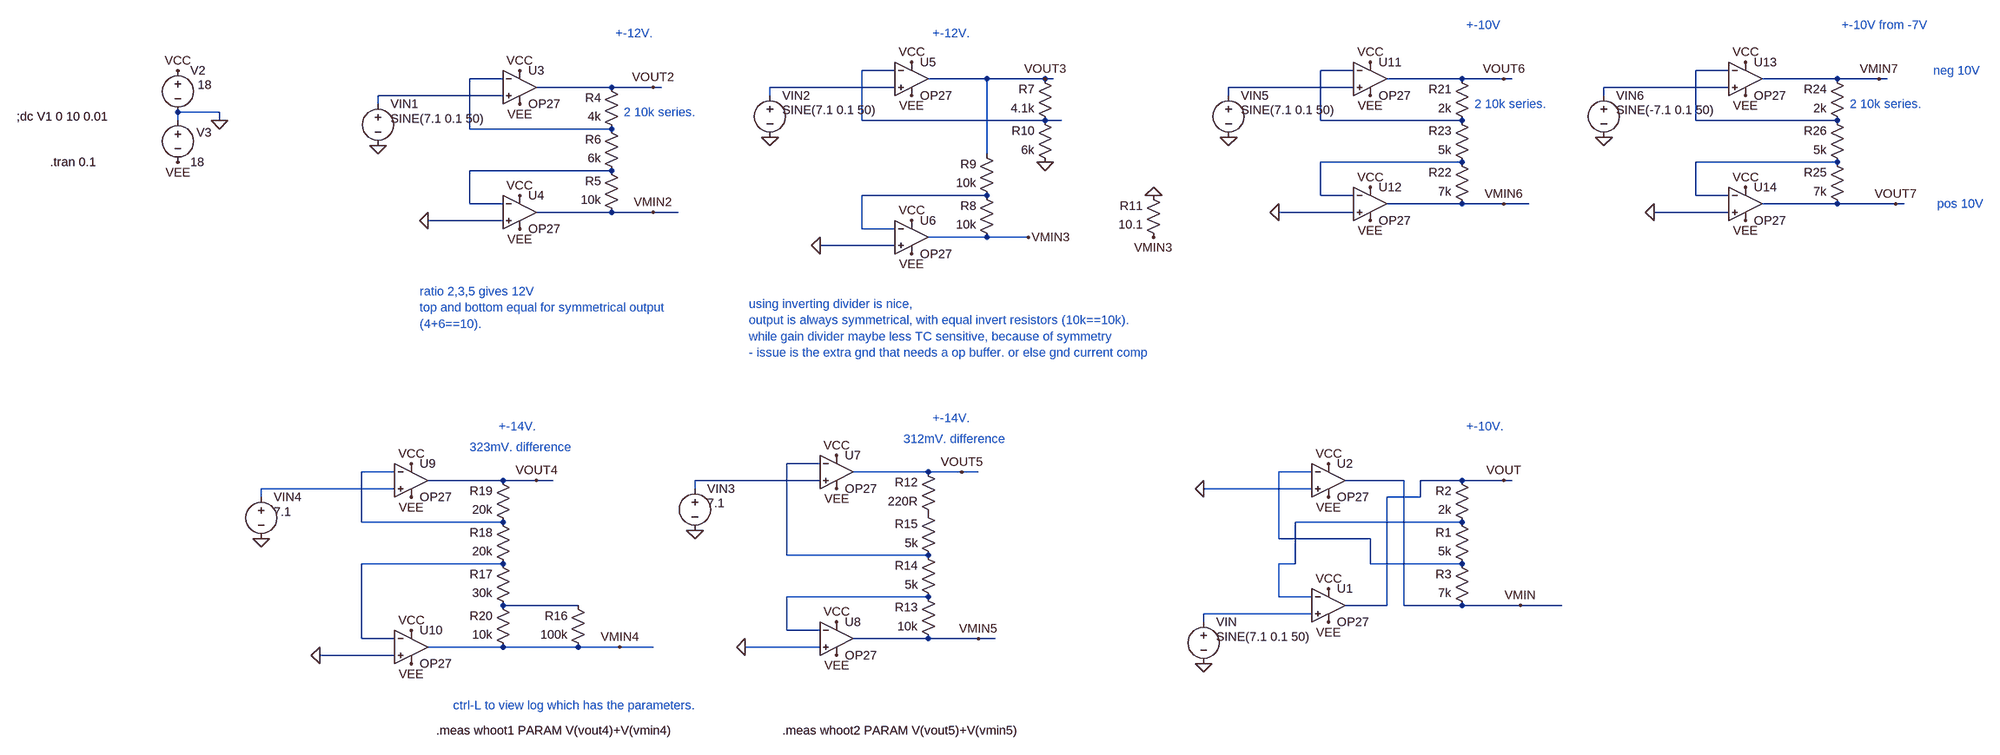
[diagram p0: schematic Draft23.asc]
Draft23.asc, the LTspice schematic file:
Version 4
SHEET 1 3336 1280
WIRE 1232 -48 1168 -48
WIRE 2112 -48 2048 -48
WIRE 2832 -48 2768 -48
WIRE 480 -32 416 -32
WIRE 1408 -32 1296 -32
WIRE 1520 -32 1408 -32
WIRE 1536 -32 1520 -32
WIRE 2320 -32 2176 -32
WIRE 2400 -32 2320 -32
WIRE 2416 -32 2400 -32
WIRE 3040 -32 2896 -32
WIRE 3120 -32 3040 -32
WIRE 3136 -32 3120 -32
WIRE 688 -16 544 -16
WIRE 768 -16 688 -16
WIRE 784 -16 768 -16
WIRE 1232 -16 992 -16
WIRE 2112 -16 1872 -16
WIRE 2832 -16 2592 -16
WIRE 480 0 240 0
WIRE 992 0 992 -16
WIRE 1872 0 1872 -16
WIRE 2592 0 2592 -16
WIRE 240 16 240 0
WIRE -64 32 -144 32
WIRE -144 48 -144 32
WIRE -64 48 -64 32
WIRE 1168 48 1168 -48
WIRE 1520 48 1168 48
WIRE 1552 48 1520 48
WIRE 2048 48 2048 -48
WIRE 2320 48 2048 48
WIRE 2768 48 2768 -48
WIRE 3040 48 2768 48
WIRE 416 64 416 -32
WIRE 688 64 416 64
WIRE 1408 112 1408 -32
WIRE 2320 128 2048 128
WIRE 3040 128 2768 128
WIRE 688 144 416 144
WIRE 1408 192 1168 192
WIRE 2048 192 2048 128
WIRE 2112 192 2048 192
WIRE 2768 192 2768 128
WIRE 2832 192 2768 192
WIRE 416 208 416 144
WIRE 480 208 416 208
WIRE 2320 208 2176 208
WIRE 2400 208 2320 208
WIRE 2448 208 2400 208
WIRE 3040 208 2896 208
WIRE 3152 208 3040 208
WIRE 3168 208 3152 208
WIRE 688 224 544 224
WIRE 768 224 688 224
WIRE 816 224 768 224
WIRE 2112 224 1968 224
WIRE 2832 224 2688 224
WIRE 480 240 336 240
WIRE 1168 256 1168 192
WIRE 1232 256 1168 256
WIRE 1408 272 1296 272
WIRE 1488 272 1408 272
WIRE 1232 288 1088 288
WIRE 1088 752 1024 752
WIRE 272 768 208 768
WIRE 1296 768 1152 768
WIRE 1360 768 1296 768
WIRE 1392 768 1360 768
WIRE 2032 768 1968 768
WIRE 480 784 336 784
WIRE 544 784 480 784
WIRE 576 784 544 784
WIRE 1088 784 848 784
WIRE 2208 784 2096 784
WIRE 2320 784 2240 784
WIRE 2400 784 2320 784
WIRE 2416 784 2400 784
WIRE 272 800 16 800
WIRE 848 800 848 784
WIRE 2032 800 1824 800
WIRE 16 816 16 800
WIRE 2240 816 2240 784
WIRE 2240 816 2176 816
WIRE 208 864 208 768
WIRE 480 864 208 864
WIRE 2320 864 2000 864
WIRE 1968 896 1968 768
WIRE 2144 896 1968 896
WIRE 1024 928 1024 752
WIRE 1296 928 1024 928
WIRE 480 944 208 944
WIRE 2000 944 2000 864
WIRE 2000 944 1968 944
WIRE 2144 944 2144 896
WIRE 2320 944 2144 944
WIRE 1296 1008 1024 1008
WIRE 1968 1008 1968 944
WIRE 2032 1008 1968 1008
WIRE 624 1024 480 1024
WIRE 2176 1024 2176 816
WIRE 2176 1024 2096 1024
WIRE 2208 1024 2208 784
WIRE 2320 1024 2208 1024
WIRE 2432 1024 2320 1024
WIRE 2512 1024 2432 1024
WIRE 2032 1040 1824 1040
WIRE 1824 1056 1824 1040
WIRE 1024 1072 1024 1008
WIRE 1088 1072 1024 1072
WIRE 208 1088 208 944
WIRE 272 1088 208 1088
WIRE 1296 1088 1152 1088
WIRE 1392 1088 1296 1088
WIRE 1424 1088 1392 1088
WIRE 480 1104 336 1104
WIRE 624 1104 480 1104
WIRE 704 1104 624 1104
WIRE 768 1104 704 1104
WIRE 1088 1104 944 1104
WIRE 272 1120 128 1120
FLAG 1824 1136 0
FLAG -64 48 0
FLAG 2400 784 VOUT
FLAG -144 -48 VCC
FLAG 2064 752 VCC
FLAG -144 128 VEE
FLAG 2064 816 VEE
FLAG 2064 992 VCC
FLAG 2064 1056 VEE
FLAG 2432 1024 VMIN
FLAG 1824 800 0
FLAG 240 96 0
FLAG 768 -16 VOUT2
FLAG 512 -48 VCC
FLAG 512 16 VEE
FLAG 512 192 VCC
FLAG 512 256 VEE
FLAG 768 224 VMIN2
FLAG 336 240 0
FLAG 992 80 0
FLAG 1520 -32 VOUT3
FLAG 1264 -64 VCC
FLAG 1264 0 VEE
FLAG 1264 240 VCC
FLAG 1264 304 VEE
FLAG 1488 272 VMIN3
FLAG 1088 288 0
FLAG 1520 128 0
FLAG 1728 192 0
FLAG 1728 272 VMIN3
FLAG 848 880 0
FLAG 544 784 VOUT4
FLAG 1120 736 VCC
FLAG 1120 800 VEE
FLAG 1120 1056 VCC
FLAG 1120 1120 VEE
FLAG 704 1104 VMIN4
FLAG 944 1104 0
FLAG 16 896 0
FLAG 1360 768 VOUT5
FLAG 304 752 VCC
FLAG 304 816 VEE
FLAG 304 1072 VCC
FLAG 304 1136 VEE
FLAG 1392 1088 VMIN5
FLAG 128 1120 0
FLAG 1872 80 0
FLAG 2400 -32 VOUT6
FLAG 2144 -64 VCC
FLAG 2144 0 VEE
FLAG 2144 176 VCC
FLAG 2144 240 VEE
FLAG 2400 208 VMIN6
FLAG 1968 224 0
FLAG 2592 80 0
FLAG 3152 208 VOUT7
FLAG 2864 -64 VCC
FLAG 2864 0 VEE
FLAG 2864 176 VCC
FLAG 2864 240 VEE
FLAG 3120 -32 VMIN7
FLAG 2688 224 0
SYMBOL voltage 1824 1040 R0
WINDOW 123 0 0 Left 0
WINDOW 39 0 0 Left 0
WINDOW 3 24 44 Left 2
SYMATTR Value SINE(7.1 0.1 50)
SYMATTR InstName VIN
SYMBOL voltage -144 -64 R0
WINDOW 123 0 0 Left 0
WINDOW 39 0 0 Left 0
WINDOW 3 38 43 Left 2
SYMATTR Value 18
SYMATTR InstName V2
SYMBOL voltage -144 32 R0
WINDOW 123 0 0 Left 0
WINDOW 39 0 0 Left 0
WINDOW 0 36 39 Left 2
SYMATTR InstName V3
SYMATTR Value 18
SYMBOL res 2336 880 R180
WINDOW 0 36 76 Left 2
WINDOW 3 36 40 Left 2
SYMATTR InstName R2
SYMATTR Value 2k
SYMBOL res 2336 1040 R180
WINDOW 0 36 76 Left 2
WINDOW 3 36 40 Left 2
SYMATTR InstName R3
SYMATTR Value 7k
SYMBOL OpAmps\\OP27 2064 720 R0
SYMATTR InstName U2
SYMBOL OpAmps\\OP27 2064 960 R0
SYMATTR InstName U1
SYMBOL res 2336 960 R180
WINDOW 0 36 76 Left 2
WINDOW 3 36 40 Left 2
SYMATTR InstName R1
SYMATTR Value 5k
SYMBOL voltage 240 0 R0
WINDOW 123 0 0 Left 0
WINDOW 39 0 0 Left 0
WINDOW 3 24 44 Left 2
SYMATTR Value SINE(7.1 0.1 50)
SYMATTR InstName VIN1
SYMBOL res 704 80 R180
WINDOW 0 36 76 Left 2
WINDOW 3 36 40 Left 2
SYMATTR InstName R4
SYMATTR Value 4k
SYMBOL res 704 240 R180
WINDOW 0 36 76 Left 2
WINDOW 3 36 40 Left 2
SYMATTR InstName R5
SYMATTR Value 10k
SYMBOL OpAmps\\OP27 512 -80 R0
SYMATTR InstName U3
SYMBOL OpAmps\\OP27 512 160 R0
SYMATTR InstName U4
SYMBOL res 704 160 R180
WINDOW 0 36 76 Left 2
WINDOW 3 36 40 Left 2
SYMATTR InstName R6
SYMATTR Value 6k
SYMBOL voltage 992 -16 R0
WINDOW 123 0 0 Left 0
WINDOW 39 0 0 Left 0
WINDOW 3 24 44 Left 2
SYMATTR Value SINE(7.1 0.1 50)
SYMATTR InstName VIN2
SYMBOL res 1536 64 R180
WINDOW 0 36 76 Left 2
WINDOW 3 36 40 Left 2
SYMATTR InstName R7
SYMATTR Value 4.1k
SYMBOL res 1424 288 R180
WINDOW 0 36 76 Left 2
WINDOW 3 36 40 Left 2
SYMATTR InstName R8
SYMATTR Value 10k
SYMBOL OpAmps\\OP27 1264 -96 R0
SYMATTR InstName U5
SYMBOL OpAmps\\OP27 1264 208 R0
SYMATTR InstName U6
SYMBOL res 1424 208 R180
WINDOW 0 36 76 Left 2
WINDOW 3 36 40 Left 2
SYMATTR InstName R9
SYMATTR Value 10k
SYMBOL res 1536 144 R180
WINDOW 0 36 76 Left 2
WINDOW 3 36 40 Left 2
SYMATTR InstName R10
SYMATTR Value 6k
SYMBOL res 1744 288 R180
WINDOW 0 36 76 Left 2
WINDOW 3 36 40 Left 2
SYMATTR InstName R11
SYMATTR Value 10.1
SYMBOL voltage 848 784 R0
WINDOW 123 0 0 Left 0
WINDOW 39 0 0 Left 0
WINDOW 3 24 44 Left 2
SYMATTR Value 7.1
SYMATTR InstName VIN3
SYMBOL res 1312 864 R180
WINDOW 0 36 76 Left 2
WINDOW 3 36 40 Left 2
SYMATTR InstName R12
SYMATTR Value 220R
SYMBOL res 1312 1104 R180
WINDOW 0 36 76 Left 2
WINDOW 3 36 40 Left 2
SYMATTR InstName R13
SYMATTR Value 10k
SYMBOL OpAmps\\OP27 1120 704 R0
SYMATTR InstName U7
SYMBOL OpAmps\\OP27 1120 1024 R0
SYMATTR InstName U8
SYMBOL res 1312 1024 R180
WINDOW 0 36 76 Left 2
WINDOW 3 36 40 Left 2
SYMATTR InstName R14
SYMATTR Value 5k
SYMBOL res 1312 944 R180
WINDOW 0 36 76 Left 2
WINDOW 3 36 40 Left 2
SYMATTR InstName R15
SYMATTR Value 5k
SYMBOL voltage 16 800 R0
WINDOW 123 0 0 Left 0
WINDOW 39 0 0 Left 0
WINDOW 3 24 44 Left 2
SYMATTR Value 7.1
SYMATTR InstName VIN4
SYMBOL res 496 1040 R180
WINDOW 0 36 76 Left 2
WINDOW 3 36 40 Left 2
SYMATTR InstName R17
SYMATTR Value 30k
SYMBOL OpAmps\\OP27 304 720 R0
SYMATTR InstName U9
SYMBOL OpAmps\\OP27 304 1040 R0
SYMATTR InstName U10
SYMBOL res 496 960 R180
WINDOW 0 36 76 Left 2
WINDOW 3 36 40 Left 2
SYMATTR InstName R18
SYMATTR Value 20k
SYMBOL res 496 880 R180
WINDOW 0 36 76 Left 2
WINDOW 3 36 40 Left 2
SYMATTR InstName R19
SYMATTR Value 20k
SYMBOL res 496 1120 R180
WINDOW 0 36 76 Left 2
WINDOW 3 36 40 Left 2
SYMATTR InstName R20
SYMATTR Value 10k
SYMBOL res 640 1120 R180
WINDOW 0 36 76 Left 2
WINDOW 3 36 40 Left 2
SYMATTR InstName R16
SYMATTR Value 100k
SYMBOL voltage 1872 -16 R0
WINDOW 123 0 0 Left 0
WINDOW 39 0 0 Left 0
WINDOW 3 24 44 Left 2
SYMATTR Value SINE(7.1 0.1 50)
SYMATTR InstName VIN5
SYMBOL res 2336 64 R180
WINDOW 0 36 76 Left 2
WINDOW 3 36 40 Left 2
SYMATTR InstName R21
SYMATTR Value 2k
SYMBOL res 2336 224 R180
WINDOW 0 36 76 Left 2
WINDOW 3 36 40 Left 2
SYMATTR InstName R22
SYMATTR Value 7k
SYMBOL OpAmps\\OP27 2144 -96 R0
SYMATTR InstName U11
SYMBOL OpAmps\\OP27 2144 144 R0
SYMATTR InstName U12
SYMBOL res 2336 144 R180
WINDOW 0 36 76 Left 2
WINDOW 3 36 40 Left 2
SYMATTR InstName R23
SYMATTR Value 5k
SYMBOL voltage 2592 -16 R0
WINDOW 123 0 0 Left 0
WINDOW 39 0 0 Left 0
WINDOW 3 24 44 Left 2
SYMATTR Value SINE(-7.1 0.1 50)
SYMATTR InstName VIN6
SYMBOL res 3056 64 R180
WINDOW 0 36 76 Left 2
WINDOW 3 36 40 Left 2
SYMATTR InstName R24
SYMATTR Value 2k
SYMBOL res 3056 224 R180
WINDOW 0 36 76 Left 2
WINDOW 3 36 40 Left 2
SYMATTR InstName R25
SYMATTR Value 7k
SYMBOL OpAmps\\OP27 2864 -96 R0
SYMATTR InstName U13
SYMBOL OpAmps\\OP27 2864 144 R0
SYMATTR InstName U14
SYMBOL res 3056 144 R180
WINDOW 0 36 76 Left 2
WINDOW 3 36 40 Left 2
SYMATTR InstName R26
SYMATTR Value 5k
TEXT -480 40 Left 2 !;dc V1 0 10 0.01
TEXT -416 128 Left 2 !.tran 0.1
TEXT 2328 680 Left 2 ;+-10V.
TEXT 696 -120 Left 2 ;+-12V.
TEXT 712 32 Left 2 ;2 10k series.
TEXT 320 376 Left 2 ;ratio 2,3,5 gives 12V\ntop and bottom equal for symmetrical output \n(4+6==10).
TEXT 952 400 Left 2 ;using inverting divider is nice,\noutput is always symmetrical, with equal invert resistors (10k==10k).\nwhile gain divider maybe less TC sensitive, because of symmetry\n- issue is the extra gnd that needs a op buffer. or else gnd current comp
TEXT 1304 -120 Left 2 ;+-12V.
TEXT 1304 664 Left 2 ;+-14V.
TEXT 1248 704 Left 2 ;312mV. difference
TEXT 472 680 Left 2 ;+-14V.
TEXT 416 720 Left 2 ;323mV. difference
TEXT 352 1264 Left 2 !.meas whoot1 PARAM V(vout4)+V(vmin4)
TEXT 1016 1264 Left 2 !.meas whoot2 PARAM V(vout5)+V(vmin5)
TEXT 384 1216 Left 2 ;ctrl-L to view log which has the parameters.
TEXT 2328 -136 Left 2 ;+-10V
TEXT 2344 16 Left 2 ;2 10k series.
TEXT 3048 -136 Left 2 ;+-10V from -7V
TEXT 3064 16 Left 2 ;2 10k series.
TEXT 3232 208 Left 2 ;pos 10V
TEXT 3224 -48 Left 2 ;neg 10V

The netlist it stands for:
* Draft23.asc
VIN N022 0 SINE(7.1 0.1 50)
V2 VCC 0 18
V3 0 VEE 18
R2 N018 VOUT 2k
R3 VMIN N015 7k
XU2 0 N015 VCC VEE VMIN OP27  ; pins In+ In- V+ V- OUT
XU1 N022 N018 VCC VEE VOUT OP27  ; pins In+ In- V+ V- OUT
R1 N015 N018 5k
VIN1 N008 0 SINE(7.1 0.1 50)
R4 N004 VOUT2 4k
R5 VMIN2 N011 10k
XU3 N008 N004 VCC VEE VOUT2 OP27  ; pins In+ In- V+ V- OUT
XU4 0 N011 VCC VEE VMIN2 OP27  ; pins In+ In- V+ V- OUT
R6 N011 N004 6k
VIN2 N005 0 SINE(7.1 0.1 50)
R7 N001 VOUT3 4.1k
R8 VMIN3 N012 10k
XU5 N005 N001 VCC VEE VOUT3 OP27  ; pins In+ In- V+ V- OUT
XU6 0 N012 VCC VEE VMIN3 OP27  ; pins In+ In- V+ V- OUT
R9 N012 VOUT3 10k
R10 0 N001 6k
R11 VMIN3 0 10.1
VIN3 N016 0 7.1
R12 P001 VOUT5 220R
R13 VMIN5 N020 10k
XU7 N016 N013 VCC VEE VOUT5 OP27  ; pins In+ In- V+ V- OUT
XU8 0 N020 VCC VEE VMIN5 OP27  ; pins In+ In- V+ V- OUT
R14 N020 N013 5k
R15 N013 P001 5k
VIN4 N017 0 7.1
R17 N021 N019 30k
XU9 N017 N014 VCC VEE VOUT4 OP27  ; pins In+ In- V+ V- OUT
XU10 0 N019 VCC VEE VMIN4 OP27  ; pins In+ In- V+ V- OUT
R18 N019 N014 20k
R19 N014 VOUT4 20k
R20 VMIN4 N021 10k
R16 VMIN4 N021 100k
VIN5 N006 0 SINE(7.1 0.1 50)
R21 N002 VOUT6 2k
R22 VMIN6 N009 7k
XU11 N006 N002 VCC VEE VOUT6 OP27  ; pins In+ In- V+ V- OUT
XU12 0 N009 VCC VEE VMIN6 OP27  ; pins In+ In- V+ V- OUT
R23 N009 N002 5k
VIN6 N007 0 SINE(-7.1 0.1 50)
R24 N003 VMIN7 2k
R25 VOUT7 N010 7k
XU13 N007 N003 VCC VEE VMIN7 OP27  ; pins In+ In- V+ V- OUT
XU14 0 N010 VCC VEE VOUT7 OP27  ; pins In+ In- V+ V- OUT
R26 N010 N003 5k
;dc V1 0 10 0.01
.tran 0.1
* +-10V.
* +-12V.
* 2 10k series.
* ratio 2,3,5 gives 12V
* top and bottom equal for symmetrical output
* (4+6==10).
* using inverting divider is nice,
* output is always symmetrical, with equal invert resistors (10k==10k).
* while gain divider maybe less TC sensitive, because of symmetry
* - issue is the extra gnd that needs a op buffer. or else gnd current comp
* +-12V.
* +-14V.
* 312mV. difference
* +-14V.
* 323mV. difference
.meas whoot1 PARAM V(vout4)+V(vmin4)
.meas whoot2 PARAM V(vout5)+V(vmin5)
* ctrl-L to view log which has the parameters.
* +-10V
* 2 10k series.
* +-10V from -7V
* 2 10k series.
* pos 10V
* neg 10V
.lib ADI.lib
.backanno
.end